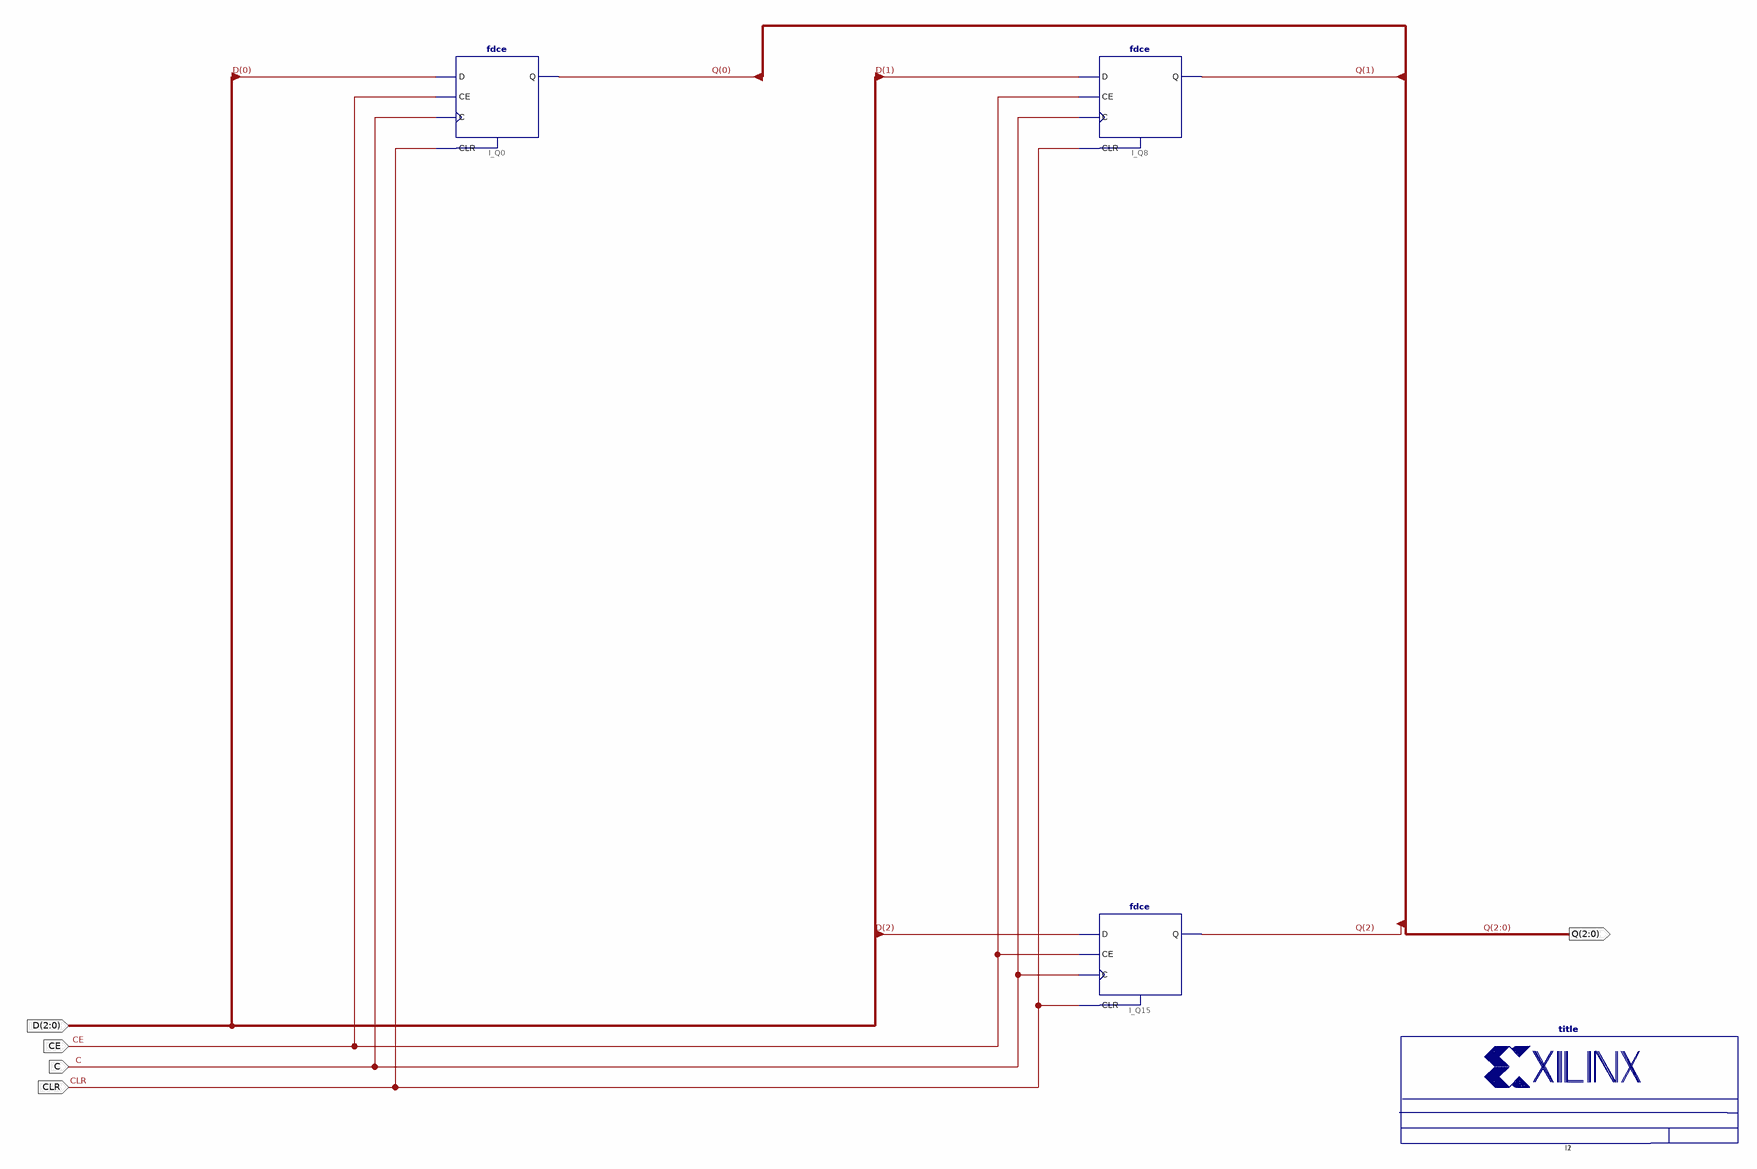
[diagram p0: schematic sheet 1]
// Xilinx ISE schematic fd3ce.sch (spartan3e) as structural Verilog: 5 symbols, 5 ports
module fd3ce (
  input  C,
  input  [2:0] D,
  input  CLR,
  input  CE,
  output [2:0] Q
);

  fdce I_Q0 (.C(C), .CE(CE), .CLR(CLR), .D(D[0]), .Q(Q[0]));
  fdce I_Q8 (.C(C), .CE(CE), .CLR(CLR), .D(D[1]), .Q(Q[1]));
  fdce I_Q15 (.C(C), .CE(CE), .CLR(CLR), .D(D[2]), .Q(Q[2]));
  title I1 ();
  title I2 ();
endmodule
